# Altium schematic sheet Sheet.02.Arduino.Mega2560.SchDoc
size A2
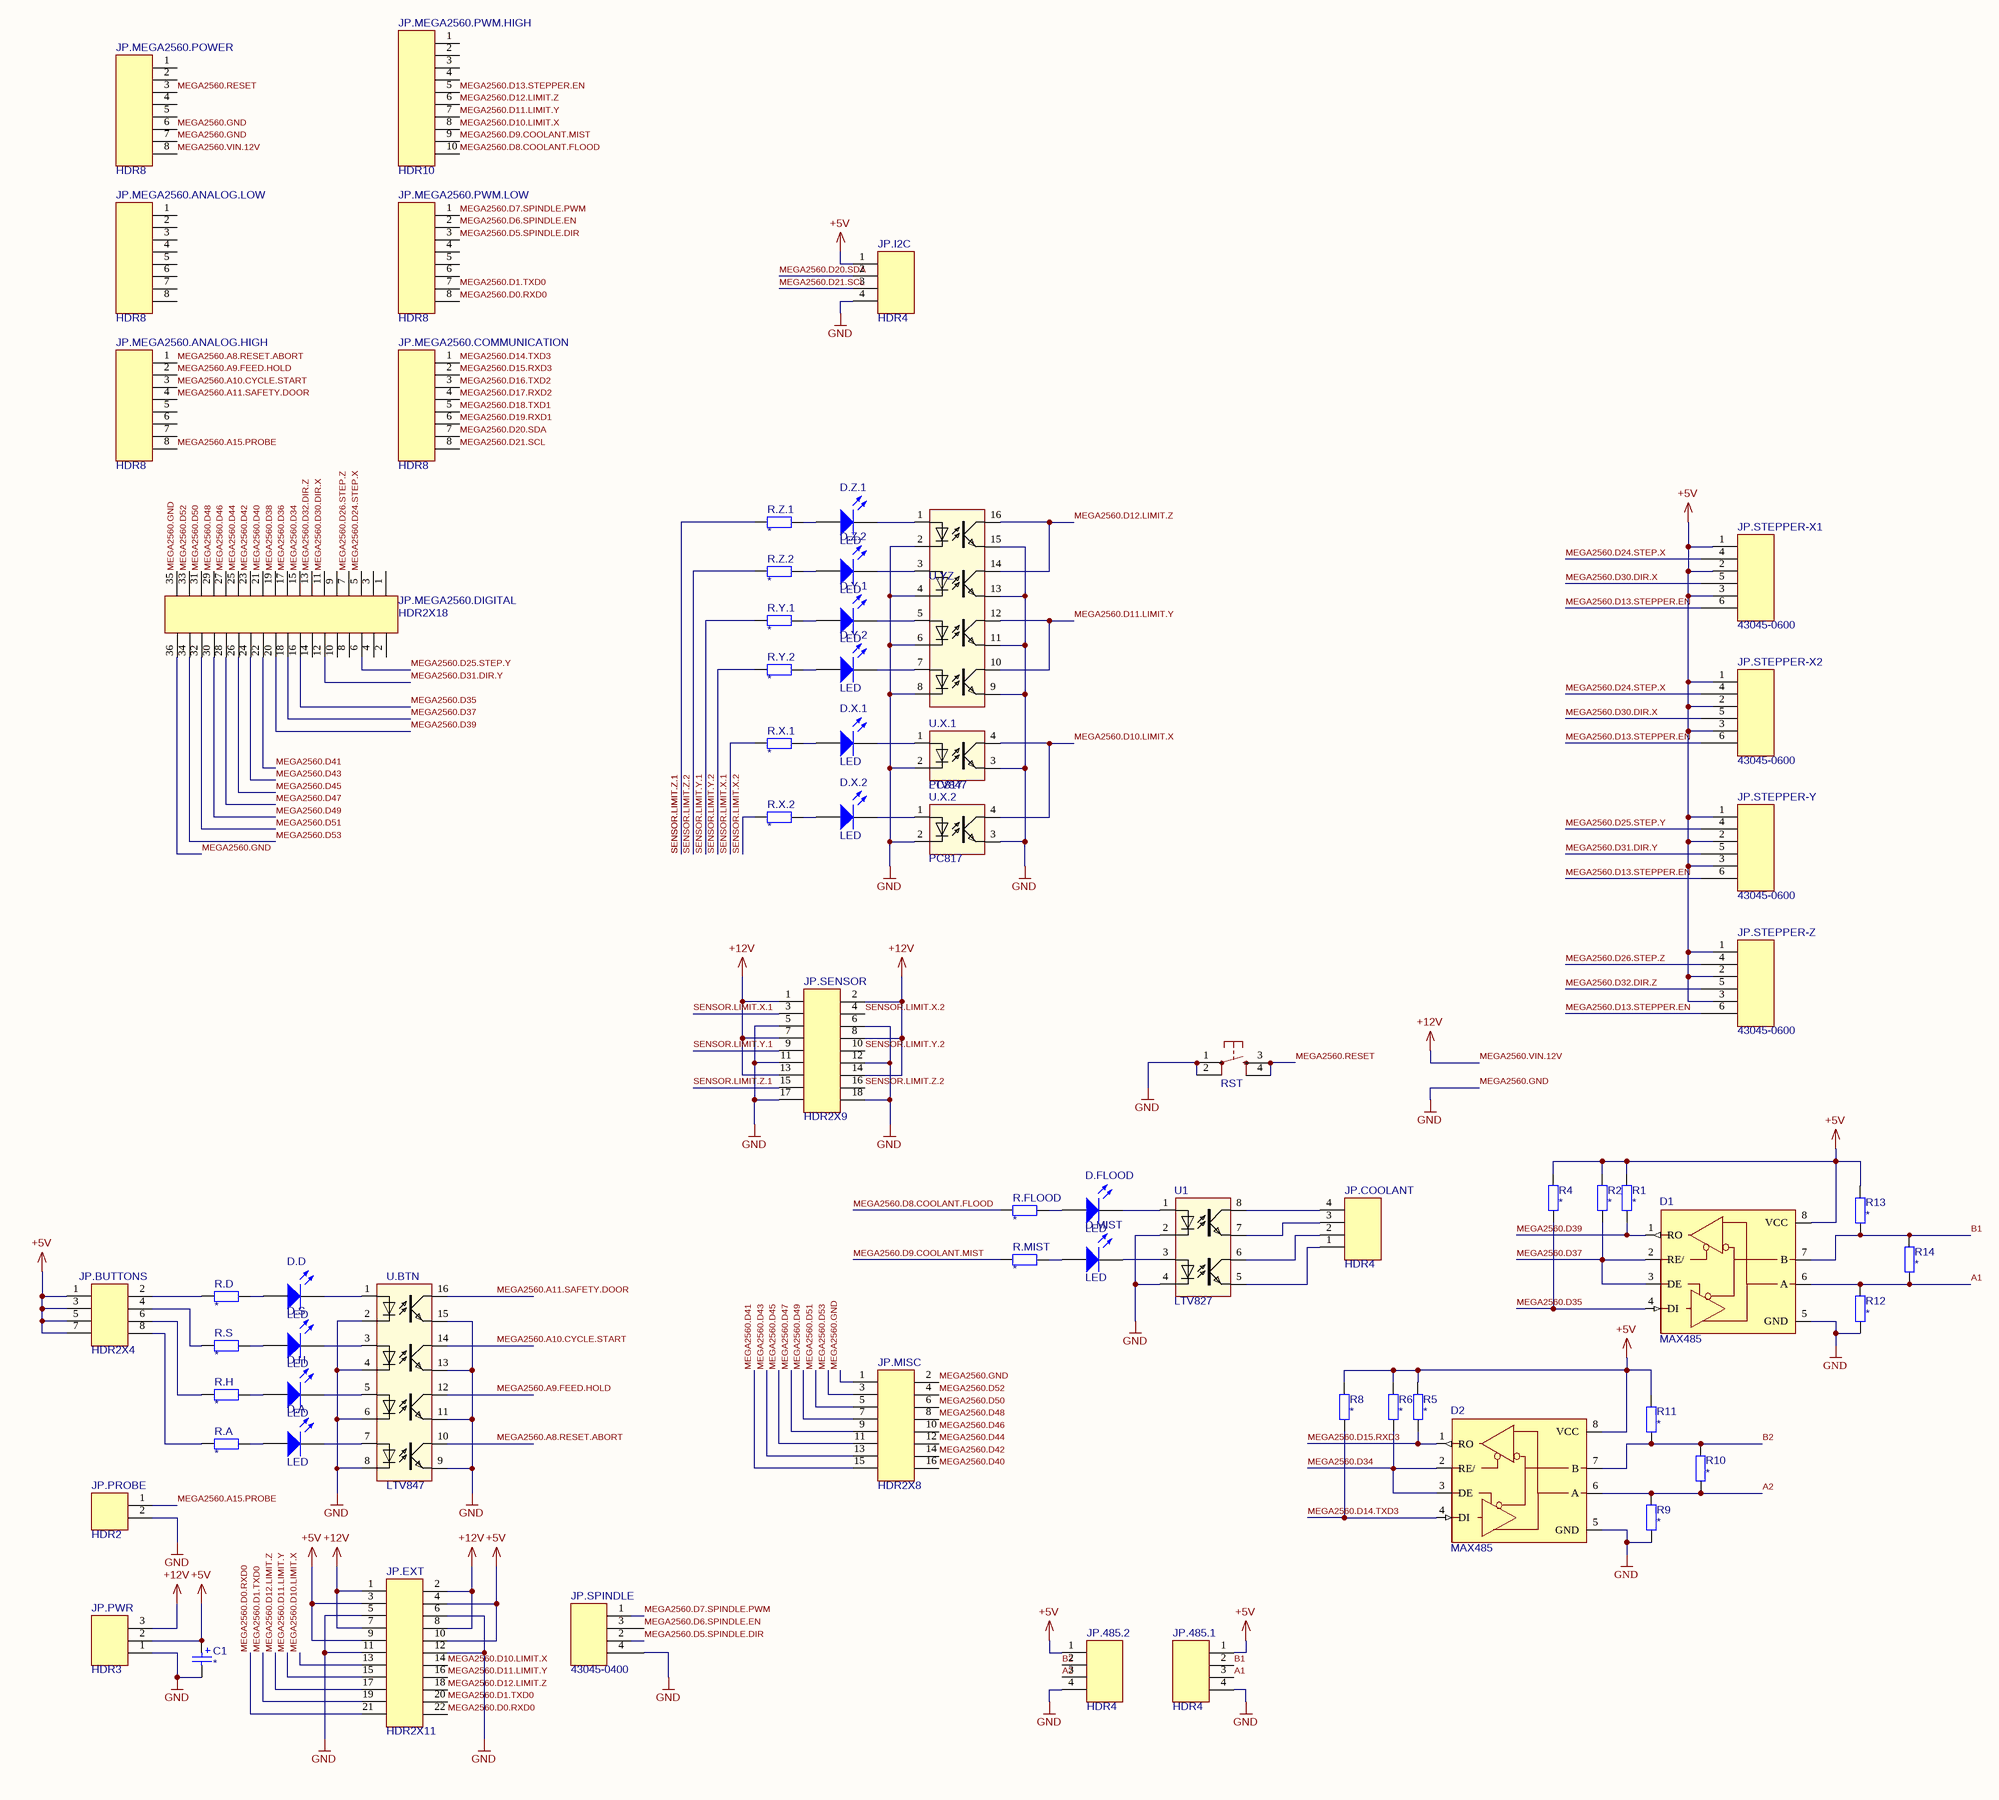
[diagram p0: Sheet.02.Arduino.Mega2560.SchDoc]

## Parts
C1  *  [E3,5-8]
D1  MAX485  [DIP8]
D2  MAX485  [DIP8]
D.A  LED  [1206-SMD-LED]
D.D  LED  [1206-SMD-LED]
D.FLOOD  LED  [1206-SMD-LED]
D.H  LED  [1206-SMD-LED]
D.MIST  LED  [1206-SMD-LED]
D.S  LED  [1206-SMD-LED]
D.X.1  LED  [1206-SMD-LED]
D.X.2  LED  [1206-SMD-LED]
D.Y.1  LED  [1206-SMD-LED]
D.Y.2  LED  [1206-SMD-LED]
D.Z.1  LED  [1206-SMD-LED]
D.Z.2  LED  [1206-SMD-LED]
JP.485.1  HDR4  [HDR1X4]
JP.485.2  HDR4  [HDR1X4]
JP.BUTTONS  HDR2X4  [HDR2X4]
JP.COOLANT  HDR4  [HDR1X4H]
JP.EXT  HDR2X11  [HDR2X11]
JP.I2C  HDR4  [HDR1X4]
JP.MEGA2560.ANALOG.HIGH  HDR8  [HDR8-BOTTOM]
JP.MEGA2560.ANALOG.LOW  HDR8  [HDR8-BOTTOM]
JP.MEGA2560.COMMUNICATION  HDR8  [HDR8-BOTTOM]
JP.MEGA2560.DIGITAL  HDR2X18  [HDR2X18-BOTTOM]
JP.MEGA2560.POWER  HDR8  [HDR8-BOTTOM]
JP.MEGA2560.PWM.HIGH  HDR10  [HDR10-BOTTOM]
JP.MEGA2560.PWM.LOW  HDR8  [HDR8-BOTTOM]
JP.MISC  HDR2X8  [HDR2X8]
JP.PROBE  HDR2  [HDR1X2]
JP.PWR  HDR3  [HDR1X3H]
JP.SENSOR  HDR2X9  [HDR2X9]
JP.SPINDLE  43045-0400  [43045-0400]
JP.STEPPER-X1  43045-0600  [43045-0600]
JP.STEPPER-X2  43045-0600  [43045-0600]
JP.STEPPER-Y  43045-0600  [43045-0600]
JP.STEPPER-Z  43045-0600  [43045-0600]
R1  *  [1206-SMD-RES]
R2  *  [1206-SMD-RES]
R4  *  [1206-SMD-RES]
R5  *  [1206-SMD-RES]
R6  *  [1206-SMD-RES]
R8  *  [1206-SMD-RES]
R9  *  [1206-SMD-RES]
R10  *  [1206-SMD-RES]
R11  *  [1206-SMD-RES]
R12  *  [1206-SMD-RES]
R13  *  [1206-SMD-RES]
R14  *  [1206-SMD-RES]
R.A  *  [1206-SMD-RES]
R.D  *  [1206-SMD-RES]
R.FLOOD  *  [1206-SMD-RES]
R.H  *  [1206-SMD-RES]
R.MIST  *  [1206-SMD-RES]
R.S  *  [1206-SMD-RES]
R.X.1  *  [1206-SMD-RES]
R.X.2  *  [1206-SMD-RES]
R.Y.1  *  [1206-SMD-RES]
R.Y.2  *  [1206-SMD-RES]
R.Z.1  *  [1206-SMD-RES]
R.Z.2  *  [1206-SMD-RES]
RST  OMRON SWITCH  [B3F-10XX]  (value not drawn)
U1  LTV827  [DIP8]
U.BTN  LTV847  [DIP16]
U.X.1  PC817  [DIP4]
U.X.2  PC817  [DIP4]
U.YZ  LTV847  [DIP16]

## Nets
+5V: C1.+ D1.8(VCC) D2.8(VCC) JP.485.1.1 JP.485.2.1 JP.BUTTONS.1 JP.BUTTONS.3 JP.BUTTONS.5 JP.BUTTONS.7 JP.EXT.3 JP.EXT.4 JP.EXT.9 JP.EXT.10 JP.I2C.1 JP.PWR.2 JP.STEPPER-X1.1 JP.STEPPER-X1.2 JP.STEPPER-X1.3 JP.STEPPER-X2.1 JP.STEPPER-X2.2 JP.STEPPER-X2.3 JP.STEPPER-Y.1 JP.STEPPER-Y.2 JP.STEPPER-Y.3 JP.STEPPER-Z.1 JP.STEPPER-Z.2 JP.STEPPER-Z.3 R1.2 R2.2 R4.2 R5.2 R6.2 R8.2 R11.2 R13.2
MEGA2560.GND: C1.- D1.5(GND) D2.5(GND) JP.485.1.4 JP.485.2.4 JP.EXT.5 JP.EXT.6 JP.EXT.11 JP.EXT.12 JP.I2C.4 JP.MEGA2560.DIGITAL.35 JP.MEGA2560.DIGITAL.36 JP.MEGA2560.POWER.6 JP.MEGA2560.POWER.7 JP.MISC.1 JP.MISC.2 JP.PROBE.2 JP.PWR.1 JP.SENSOR.5 JP.SENSOR.6 JP.SENSOR.11 JP.SENSOR.12 JP.SENSOR.17 JP.SENSOR.18 JP.SPINDLE.4 R9.1 R12.1 RST.1(S) RST.2(S1) U1.2 U1.4 U.BTN.2 U.BTN.4 U.BTN.6 U.BTN.8 U.BTN.9 U.BTN.11 U.BTN.13 U.BTN.15 U.X.1.2 U.X.1.3 U.X.2.2 U.X.2.3 U.YZ.2 U.YZ.4 U.YZ.6 U.YZ.8 U.YZ.9 U.YZ.11 U.YZ.13 U.YZ.15  [also labelled GND]
MEGA2560.VIN.12V: JP.EXT.1 JP.EXT.2 JP.EXT.7 JP.EXT.8 JP.MEGA2560.POWER.8 JP.PWR.3 JP.SENSOR.1 JP.SENSOR.2 JP.SENSOR.7 JP.SENSOR.8 JP.SENSOR.13 JP.SENSOR.14  [also labelled +12V]
A1: D1.6(A) JP.485.1.3 R12.2 R14.1
A2: D2.6(A) JP.485.2.3 R9.2 R10.1
B1: D1.7(B) JP.485.1.2 R13.1 R14.2
B2: D2.7(B) JP.485.2.2 R10.2 R11.1
MEGA2560.A8.RESET.ABORT: JP.MEGA2560.ANALOG.HIGH.1 U.BTN.10
MEGA2560.A9.FEED.HOLD: JP.MEGA2560.ANALOG.HIGH.2 U.BTN.12
MEGA2560.A10.CYCLE.START: JP.MEGA2560.ANALOG.HIGH.3 U.BTN.14
MEGA2560.A11.SAFETY.DOOR: JP.MEGA2560.ANALOG.HIGH.4 U.BTN.16
MEGA2560.A15.PROBE: JP.MEGA2560.ANALOG.HIGH.8 JP.PROBE.1
MEGA2560.D0.RXD0: JP.EXT.21 JP.EXT.22 JP.MEGA2560.PWM.LOW.8
MEGA2560.D1.TXD0: JP.EXT.19 JP.EXT.20 JP.MEGA2560.PWM.LOW.7
MEGA2560.D5.SPINDLE.DIR: JP.MEGA2560.PWM.LOW.3 JP.SPINDLE.2
MEGA2560.D6.SPINDLE.EN: JP.MEGA2560.PWM.LOW.2 JP.SPINDLE.3
MEGA2560.D7.SPINDLE.PWM: JP.MEGA2560.PWM.LOW.1 JP.SPINDLE.1
MEGA2560.D8.COOLANT.FLOOD: JP.MEGA2560.PWM.HIGH.10 R.FLOOD.1
MEGA2560.D9.COOLANT.MIST: JP.MEGA2560.PWM.HIGH.9 R.MIST.1
MEGA2560.D10.LIMIT.X: JP.EXT.13 JP.EXT.14 JP.MEGA2560.PWM.HIGH.8 U.X.1.4 U.X.2.4
MEGA2560.D11.LIMIT.Y: JP.EXT.15 JP.EXT.16 JP.MEGA2560.PWM.HIGH.7 U.YZ.10 U.YZ.12
MEGA2560.D12.LIMIT.Z: JP.EXT.17 JP.EXT.18 JP.MEGA2560.PWM.HIGH.6 U.YZ.14 U.YZ.16
MEGA2560.D13.STEPPER.EN: JP.MEGA2560.PWM.HIGH.5 JP.STEPPER-X1.6 JP.STEPPER-X2.6 JP.STEPPER-Y.6 JP.STEPPER-Z.6
MEGA2560.D14.TXD3: D2.4(DI) JP.MEGA2560.COMMUNICATION.1 R8.1
MEGA2560.D15.RXD3: D2.1(RO) JP.MEGA2560.COMMUNICATION.2 R5.1
MEGA2560.D16.TXD2: JP.MEGA2560.COMMUNICATION.3
MEGA2560.D17.RXD2: JP.MEGA2560.COMMUNICATION.4
MEGA2560.D18.TXD1: JP.MEGA2560.COMMUNICATION.5
MEGA2560.D19.RXD1: JP.MEGA2560.COMMUNICATION.6
MEGA2560.D20.SDA: JP.I2C.2 JP.MEGA2560.COMMUNICATION.7
MEGA2560.D21.SCL: JP.I2C.3 JP.MEGA2560.COMMUNICATION.8
MEGA2560.D24.STEP.X: JP.MEGA2560.DIGITAL.5 JP.STEPPER-X1.4 JP.STEPPER-X2.4
MEGA2560.D25.STEP.Y: JP.MEGA2560.DIGITAL.6 JP.STEPPER-Y.4
MEGA2560.D26.STEP.Z: JP.MEGA2560.DIGITAL.7 JP.STEPPER-Z.4
MEGA2560.D30.DIR.X: JP.MEGA2560.DIGITAL.11 JP.STEPPER-X1.5 JP.STEPPER-X2.5
MEGA2560.D31.DIR.Y: JP.MEGA2560.DIGITAL.12 JP.STEPPER-Y.5
MEGA2560.D32.DIR.Z: JP.MEGA2560.DIGITAL.13 JP.STEPPER-Z.5
MEGA2560.D34: D2.2(RE/) D2.3(DE) JP.MEGA2560.DIGITAL.15 R6.1
MEGA2560.D35: D1.4(DI) JP.MEGA2560.DIGITAL.16 R4.1
MEGA2560.D36: JP.MEGA2560.DIGITAL.17
MEGA2560.D37: D1.2(RE/) D1.3(DE) JP.MEGA2560.DIGITAL.18 R2.1
MEGA2560.D38: JP.MEGA2560.DIGITAL.19
MEGA2560.D39: D1.1(RO) JP.MEGA2560.DIGITAL.20 R1.1
MEGA2560.D40: JP.MEGA2560.DIGITAL.21 JP.MISC.16
MEGA2560.D41: JP.MEGA2560.DIGITAL.22 JP.MISC.15
MEGA2560.D42: JP.MEGA2560.DIGITAL.23 JP.MISC.14
MEGA2560.D43: JP.MEGA2560.DIGITAL.24 JP.MISC.13
MEGA2560.D44: JP.MEGA2560.DIGITAL.25 JP.MISC.12
MEGA2560.D45: JP.MEGA2560.DIGITAL.26 JP.MISC.11
MEGA2560.D46: JP.MEGA2560.DIGITAL.27 JP.MISC.10
MEGA2560.D47: JP.MEGA2560.DIGITAL.28 JP.MISC.9
MEGA2560.D48: JP.MEGA2560.DIGITAL.29 JP.MISC.8
MEGA2560.D49: JP.MEGA2560.DIGITAL.30 JP.MISC.7
MEGA2560.D50: JP.MEGA2560.DIGITAL.31 JP.MISC.6
MEGA2560.D51: JP.MEGA2560.DIGITAL.32 JP.MISC.5
MEGA2560.D52: JP.MEGA2560.DIGITAL.33 JP.MISC.4
MEGA2560.D53: JP.MEGA2560.DIGITAL.34 JP.MISC.3
MEGA2560.RESET: JP.MEGA2560.POWER.3 RST.3(P) RST.4(P1)
SENSOR.LIMIT.X.1: JP.SENSOR.3 R.X.1.1
SENSOR.LIMIT.X.2: JP.SENSOR.4 R.X.2.1
SENSOR.LIMIT.Y.1: JP.SENSOR.9 R.Y.1.1
SENSOR.LIMIT.Y.2: JP.SENSOR.10 R.Y.2.1
SENSOR.LIMIT.Z.1: JP.SENSOR.15 R.Z.1.1
SENSOR.LIMIT.Z.2: JP.SENSOR.16 R.Z.2.1
NetD.A_1: D.A.1(A) R.A.2
NetD.A_2: D.A.2(K) U.BTN.7
NetD.D_1: D.D.1(A) R.D.2
NetD.D_2: D.D.2(K) U.BTN.1
NetD.FLOOD_1: D.FLOOD.1(A) R.FLOOD.2
NetD.FLOOD_2: D.FLOOD.2(K) U1.1
NetD.H_1: D.H.1(A) R.H.2
NetD.H_2: D.H.2(K) U.BTN.5
NetD.MIST_1: D.MIST.1(A) R.MIST.2
NetD.MIST_2: D.MIST.2(K) U1.3
NetD.S_1: D.S.1(A) R.S.2
NetD.S_2: D.S.2(K) U.BTN.3
NetD.X.1_1: D.X.1.1(A) R.X.1.2
NetD.X.1_2: D.X.1.2(K) U.X.1.1
NetD.X.2_1: D.X.2.1(A) R.X.2.2
NetD.X.2_2: D.X.2.2(K) U.X.2.1
NetD.Y.1_1: D.Y.1.1(A) R.Y.1.2
NetD.Y.1_2: D.Y.1.2(K) U.YZ.5
NetD.Y.2_1: D.Y.2.1(A) R.Y.2.2
NetD.Y.2_2: D.Y.2.2(K) U.YZ.7
NetD.Z.1_1: D.Z.1.1(A) R.Z.1.2
NetD.Z.1_2: D.Z.1.2(K) U.YZ.1
NetD.Z.2_1: D.Z.2.1(A) R.Z.2.2
NetD.Z.2_2: D.Z.2.2(K) U.YZ.3
NetJP.BUTTONS_2: JP.BUTTONS.2 R.D.1
NetJP.BUTTONS_4: JP.BUTTONS.4 R.S.1
NetJP.BUTTONS_6: JP.BUTTONS.6 R.H.1
NetJP.BUTTONS_8: JP.BUTTONS.8 R.A.1
NetJP.COOLANT_1: JP.COOLANT.1 U1.5
NetJP.COOLANT_2: JP.COOLANT.2 U1.6
NetJP.COOLANT_3: JP.COOLANT.3 U1.7
NetJP.COOLANT_4: JP.COOLANT.4 U1.8

Not connected (* = marked no-connect by the designer): JP.MEGA2560.ANALOG.HIGH 5 6 7; JP.MEGA2560.ANALOG.LOW 1 2 3 4 5 6 7 8; JP.MEGA2560.DIGITAL 1 2 3 4 8 9 10 14; JP.MEGA2560.POWER 1 2 4 5; JP.MEGA2560.PWM.HIGH 1 2 3 4; JP.MEGA2560.PWM.LOW 4 5 6

## Library data of the parts
C1 = CAP.POL: Polarized Capacitor (Radial); Published: 8-Jun-2000; LatestRevisionDate: 17-Jul-2002; LatestRevisionNote: Re-released for DXP Platform.; PackageReference: RB7.6-15; Publisher: Altium Limited; PackageDescription: Polarized Capacitor (Radial); 2 Leads; CAPACITANCE: *; VOLTAGE: *
R1 R2 R4-R6 R8-R14 R.A R.D R.FLOOD R.H R.MIST R.S R.X.1 R.X.2 R.Y.1 R.Y.2 R.Z.1 R.Z.2 = RES: VALUE: *
RST = B3F-10-XX: MPN: B3F-1000; OC_FARNELL: 176432; OC_NEWARK: 36M3542
D.A D.D D.FLOOD D.H D.MIST D.S D.X.1 D.X.2 D.Y.1 D.Y.2 D.Z.1 D.Z.2 = LED: Published: 8-Jun-2000; LatestRevisionDate: 08-Jul-2005; LatestRevisionNote: Mech Layer 1 removed.; PackageReference: LED-1; Publisher: Altium Limited; PackageDescription: LED; 2 Leads